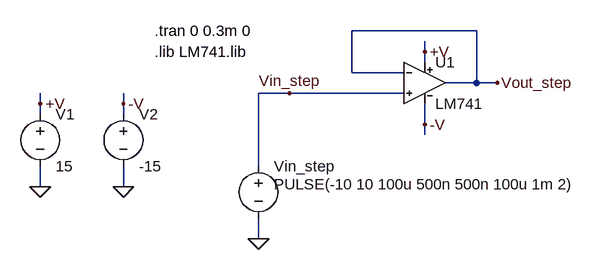
[diagram p0: schematic SlewRate.asc]
SlewRate.asc, the LTspice schematic file:
Version 4
SHEET 1 964 916
WIRE -624 352 -816 352
WIRE -704 384 -704 368
WIRE -704 400 -704 384
WIRE -816 416 -816 352
WIRE -736 416 -816 416
WIRE -624 432 -624 352
WIRE -624 432 -672 432
WIRE -592 432 -624 432
WIRE -912 448 -960 448
WIRE -736 448 -912 448
WIRE -1296 464 -1296 448
WIRE -1168 464 -1168 448
WIRE -1296 480 -1296 464
WIRE -1168 480 -1168 464
WIRE -704 496 -704 464
WIRE -704 512 -704 496
WIRE -960 560 -960 448
WIRE -1296 592 -1296 560
WIRE -1168 592 -1168 560
WIRE -960 672 -960 640
FLAG -592 432 Vout_step
FLAG -960 672 0
FLAG -1296 592 0
FLAG -1168 592 0
FLAG -1296 464 +V
FLAG -704 384 +V
FLAG -1168 464 -V
FLAG -704 496 -V
FLAG -912 448 Vin_step
SYMBOL LM741 -704 368 R0
SYMATTR InstName U1
SYMBOL voltage -1296 464 R0
WINDOW 123 0 0 Left 2
WINDOW 39 0 0 Left 2
SYMATTR InstName V1
SYMATTR Value 15
SYMBOL voltage -1168 464 R0
WINDOW 123 0 0 Left 2
WINDOW 39 0 0 Left 2
SYMATTR InstName V2
SYMATTR Value -15
SYMBOL voltage -960 544 R0
WINDOW 3 24 44 Left 2
WINDOW 123 24 72 Left 2
WINDOW 39 0 0 Left 2
SYMATTR Value PULSE(-10 10 100u 500n 500n 100u 1m 2)
SYMATTR InstName Vin_step
TEXT -1120 384 Left 2 !.lib LM741.lib
TEXT -1120 352 Left 2 !.tran 0 0.3m 0

The netlist it stands for:
* SlewRate.asc
XU1 Vin_step Vout_step +V -V Vout_step LM741  ; pins In+ In- V+ V- OUT
V1 +V 0 15
V2 -V 0 -15
Vin_step Vin_step 0 PULSE(-10 10 100u 500n 500n 100u 1m 2)
.lib LM741.lib
.tran 0 0.3m 0
.lib LM741.lib
.backanno
.end